# EAGLE schematic Dummy_load_schematic (EAGLE 9.6.2)
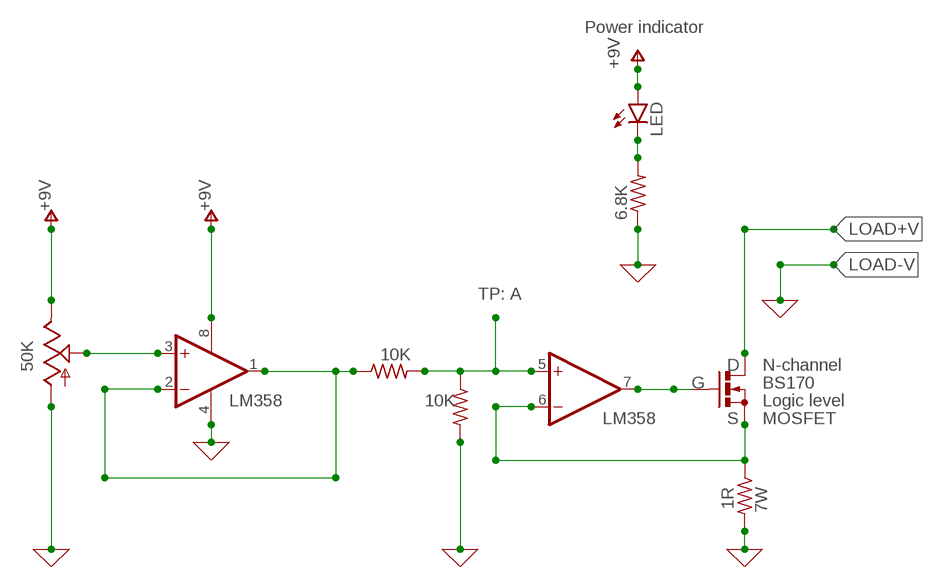
[diagram p0: schematic, sheet 1]

## Parts
6.8K  R-US_0207/7  [0207/7]
7W  1R  R-US_0207/7  [0207/7]
10K  R-US_0207/7  [0207/7]
50K  50K  US-EVUE2A  [EVUE]
LED  LED5MM  [LED5MM]
LM358  LM358  OP1277R  [SOIC8]
N-CHANNEL  BS170  [SOT54E]
R3  10K  R-US_0207/7  [0207/7]

## Nets
0: 6.8K.1 7W.2 50K.1(A) LM358.4(P:V-) R3.2 ; supply symbol labelled GND
LOAD+V: N-CHANNEL.D
N$1: 6.8K.2 LED.K(C)
N$2: 10K.2 LM358.5(B:+IN) R3.1
N$3: 50K.2(S) LM358.3(A:+IN)
N$4: 10K.1 LM358.1(A:OUT) LM358.2(A:-IN)
N$5: LM358.7(B:OUT) N-CHANNEL.G
N$6: 7W.1 LM358.6(B:-IN) N-CHANNEL.S
V+: 50K.3(E) LED.A LM358.8(P:V+) ; supply symbol labelled +9V

## Notes on the sheet
- Power indicator
- TP: A
- D | N-channel
- G
- 10K | Logic level
- S | MOSFET

## Library data of the parts
6.8K 7W 10K R3 = rcl:R-US_: RESISTOR, American symbol; SPICEPREFIX: R
50K = pot:US-EVU: 9 mm Square Rotary Potentiometers Source: Panasonic
LED = led:LED: LED OSRAM: - CHIPLED LG R971, LG N971, LY N971, LG Q971, LY Q971, LO R971, LY R971 LH N974, LH R974 LS Q976, LO Q976, LY Q976 LO Q996 - Hyper CHIPLED LW Q18S LB Q993, LB Q99A, LB R99A - SideLED LS A670, LO A670, LY A670, LG A670, LP A670 LB A673, LV A673, LT A673, LW A673 LH A674 LY A675 LS A676, LA A676, LO A676, LY A676, LW A676 LS A679, LY A679, LG A679 - Hyper Micro SIDELED® LS Y876, LA Y876, LO Y876, LY Y876 LT Y87S - SmartLED LW L88C, LW L88S LB L89C, LB L89S, LG L890 LS L89K, LO L89K, LY L89K LS L896, LA L896, LO L896, LY L896 - TOPLED LS T670, LO T670, LY T670, LG T670, LP T670 LSG T670, LSP T670, LSY T670, LOP T670, LYG T670 LG T671, LOG T671, LSG T671 LB T673, LV T673, LT T673, LW T673 LH T674 LS T676, LA T676, LO T676, LY T676, LB T676, LH T676, LSB T676, LW T676 LB T67C, LV T67C, LT T67C, LS T67K, LO T67K, LY T67K, LW E67C LS E67B, LA E67B, LO E67B, LY E67B, LB E67C, LV E67C, LT E67C LW T67C LS T679, LY T679, LG T679 LS T770, LO T770, LY T770, LG T770, LP T770 LB T773, LV T773, LT T773, LW T773 LH T774 LS E675, LA E675, LY E675, LS T675 LS T776, LA T776, LO T776, LY T776, LB T776 LHGB T686 LT T68C, LB T68C - Hyper Mini TOPLED® LB M676 - Mini TOPLED Santana® LG M470 LS M47K, LO M47K, LY M47K Source: http://www.osram.convergy.de LUXEON: - LUMILED® LXK2-PW12-R00, LXK2-PW12-S00, LXK2-PW14-U00, LXK2-PW14-V00 LXK2-PM12-R00, LXK2-PM12-S00, LXK2-PM14-U00 LXK2-PE12-Q00, LXK2-PE12-R00, LXK2-PE12-S00, LXK2-PE14-T00, LXK2-PE14-U00 LXK2-PB12-K00, LXK2-PB12-L00, LXK2-PB12-M00, LXK2-PB14-N00, LXK2-PB14-P00, LXK2-PB14-Q00 LXK2-PR12-L00, LXK2-PR12-M00, LXK2-PR14-Q00, LXK2-PR14-R00 LXK2-PD12-Q00, LXK2-PD12-R00, LXK2-PD12-S00 LXK2-PH12-R00, LXK2-PH12-S00 LXK2-PL12-P00, LXK2-PL12-Q00, LXK2-PL12-R00 Source: www.luxeon.com KINGBRIGHT: KA-3528ASYC Source: www.kingbright.com
LM358 = linear:OP1277: Precision Low Noise, Low Input Bias Current Operational Amplifiers Source: OP1177_2177_4177.pdf
N-CHANNEL = transistor-small-signal:BS170: N-CHANNEL MOS FET